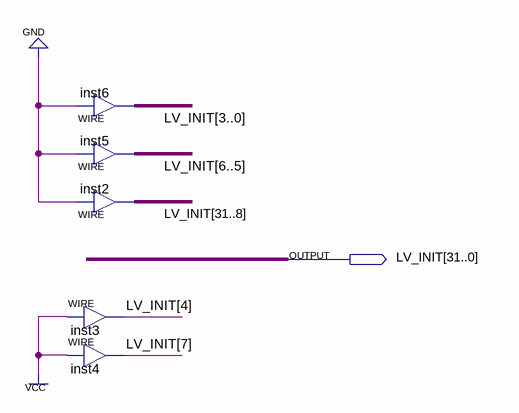
[diagram p0: schematic sheet]
// Quartus schematic Inicial_Adress_LV.bdf as structural Verilog: 5 symbols, 1 pins
module Inicial_Adress_LV (
  output [31:0] LV_INIT
);

  assign LV_INIT[3:0] = 4'b0000;  // WIRE inst6
  assign LV_INIT[6:5] = 2'b00;  // WIRE inst5
  assign LV_INIT[31:8] = {24{1'b0}};  // WIRE inst2
  assign LV_INIT[4] = 1'b1;  // WIRE inst3
  assign LV_INIT[7] = 1'b1;  // WIRE inst4
endmodule
